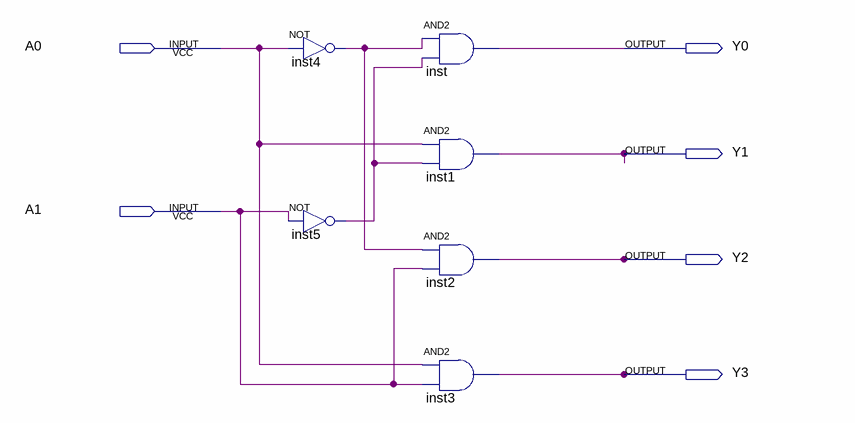
[diagram p0: schematic sheet]
// Quartus schematic decoder.bdf as structural Verilog: 6 symbols, 6 pins
module decoder (
  input  A0,
  input  A1,
  output Y0,
  output Y1,
  output Y2,
  output Y3
);

  wire inst4_out, inst5_out;

  not inst4 (inst4_out, A0);
  not inst5 (inst5_out, A1);
  and inst (Y0, inst4_out, inst5_out);
  and inst1 (Y1, A0, inst5_out);
  and inst2 (Y2, inst4_out, A1);
  and inst3 (Y3, A0, A1);
endmodule
